# Altium schematic sheet Driver Controller Tester.SchDoc
size Letter
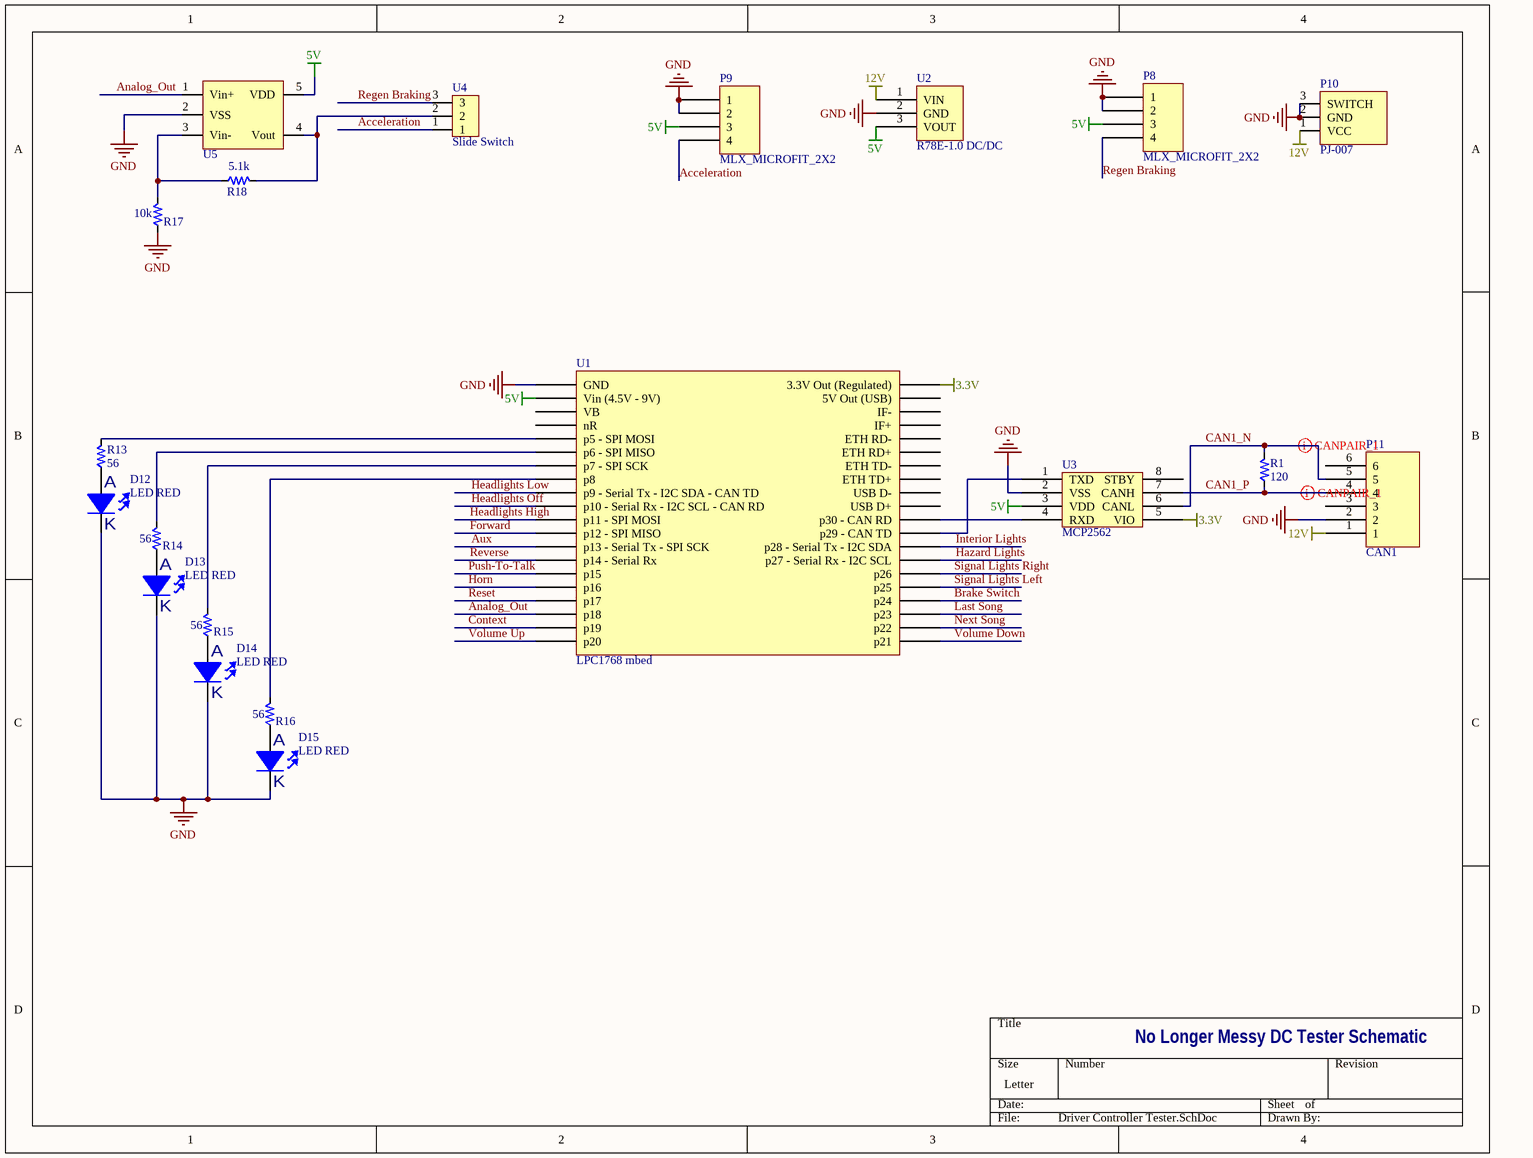
[diagram p0: Driver Controller Tester.SchDoc]

## Parts
D12  LED RED  [RED LED]
D13  LED RED  [RED LED]
D14  LED RED  [RED LED]
D15  LED RED  [RED LED]
P8  MLX_MICROFIT_2X2  [MLX_MICROFIT_2X2]
P9  MLX_MICROFIT_2X2  [MLX_MICROFIT_2X2]
P10  PJ-007  [BARREL JACK PJ007]
P11  CAN1  [PCB_MLX_MICROFIT_3X2]
R1  120  [PCB_GENERIC_SMD_0603]
R13  Resistance: 56  [PCB_GENERIC_SMD_0603]  (hidden comment: SCH_GENERIC_RESISTOR_0603)
R14  Resistance: 56  [PCB_GENERIC_SMD_0603]  (hidden comment: SCH_GENERIC_RESISTOR_0603)
R15  Resistance: 56  [PCB_GENERIC_SMD_0603]  (hidden comment: SCH_GENERIC_RESISTOR_0603)
R16  Resistance: 56  [PCB_GENERIC_SMD_0603]  (hidden comment: SCH_GENERIC_RESISTOR_0603)
R17  Resistance: 10k  [PCB_GENERIC_SMD_0603]  (hidden comment: SCH_GENERIC_RESISTOR_0603)
R18  Resistance: 5.1k  [PCB_GENERIC_SMD_0603]  (hidden comment: SCH_GENERIC_RESISTOR_0603)
U1  LPC1768 mbed  [LPC 1768 mbed Layout]
U2  R78E-1.0 DC/DC  [R78-1.0]
U3  MCP2562  [MCP2562]
U4  Slide Switch  [Slide Switch]
U5  MCP6001U  [MCP6001UT]  (value not drawn)

## Nets
3.3V: U1.40(3.3V_Out_(Regulated)) U3.5(VIO)
5V: P8.3 P9.3 U1.2(Vin_(4.5V_-_9V)) U2.3(VOUT) U3.3(VDD) U5.5(VDD)
12V: P10.1(VCC) P11.1 U2.1(VIN)
GND: D12.1 D13.1 D14.1 D15.1 P8.1 P8.2 P9.1 P9.2 P10.2(GND) P10.3(SWITCH) P11.2 R17.1 U1.1(GND) U2.2(GND) U3.2(VSS) U5.2(VSS)
Acceleration: P9.4 U4.1
Analog_Out: U1.18(p18) U5.1(Vin+)
Aux: U1.13(p13_-_Serial_Tx_-_SPI_SCK)
Brake Switch: U1.24(p24)
CAN1_N: P11.5 R1.2 U3.6(CANL)
CAN1_P: P11.4 R1.1 U3.7(CANH)
Context: U1.19(p19)
Forward: U1.12(p12_-_SPI_MISO)
Hazard Lights: U1.27(p27_-_Serial_Rx_-_I2C_SCL)
Headlights High: U1.11(p11_-_SPI_MOSI)
Headlights Low: U1.9(p9_-_Serial_Tx_-_I2C_SDA_-_CAN_TD)
Headlights Off: U1.10(p10_-_Serial_Rx_-_I2C_SCL_-_CAN_RD)
Horn: U1.16(p16)
Interior Lights: U1.28(p28_-_Serial_Tx_-_I2C_SDA)
Last Song: U1.23(p23)
Next Song: U1.22(p22)
Push-To-Talk: U1.15(p15)
Regen Braking: P8.4 U4.3
Reset: U1.17(p17)
Reverse: U1.14(p14_-_Serial_Rx)
Signal Lights Left: U1.25(p25)
Signal Lights Right: U1.26(p26)
Volume Down: U1.21(p21)
Volume Up: U1.20(p20)
NetD12_2: D12.2 R13.1
NetD13_2: D13.2 R14.1
NetD14_2: D14.2 R15.1
NetD15_2: D15.2 R16.1
NetR13_2: R13.2 U1.5(p5_-_SPI_MOSI)
NetR14_2: R14.2 U1.6(p6_-_SPI_MISO)
NetR15_2: R15.2 U1.7(p7_-_SPI_SCK)
NetR16_2: R16.2 U1.8(p8)
NetR17_2: R17.2 R18.1 U5.3(Vin-)
NetR18_2: R18.2 U4.2 U5.4(Vout)
NetU1_29: U1.29(p29_-_CAN_TD) U3.1(TXD)
NetU1_30: U1.30(p30_-_CAN_RD) U3.4(RXD)

Not connected (* = marked no-connect by the designer): P11 3 6; U1 3(VB) 4(nR) 31(USB_D+) 32(USB_D-) 33(ETH_TD+) 34(ETH_TD-) 35(ETH_RD+) 36(ETH_RD-) 37(IF+) 38(IF-) 39(5V_Out_(USB)); U3 8(STBY)

## Layout directives
differential pair: CAN1_N, CAN1_P

## Notes on the sheet
- No Longer Messy DC Tester Schematic
- (in symbol LED RED) A; K

## Library data of the parts
P10 = Component_1
P11 = SCH_MLX_MICROFIT_3X2
R1 = SCH_GENERIC_RESISTOR_0603: 120 Ohms; Resistance: 120
R13-R18 = SCH_GENERIC_RESISTOR_0603: Generic SMD resistor 0603
U2 = R78E-1.0